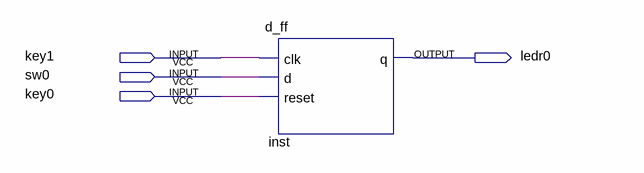
[diagram p0: schematic sheet]
// Quartus schematic d_ff_tb.bdf as structural Verilog: 1 symbols, 4 pins
module d_ff_tb (
  input  key1,
  input  sw0,
  input  key0,
  output ledr0
);

  d_ff inst (.clk(key1), .d(sw0), .reset(key0), .q(ledr0));
endmodule
